# EAGLE design TA_3 (EAGLE 9.6.2)
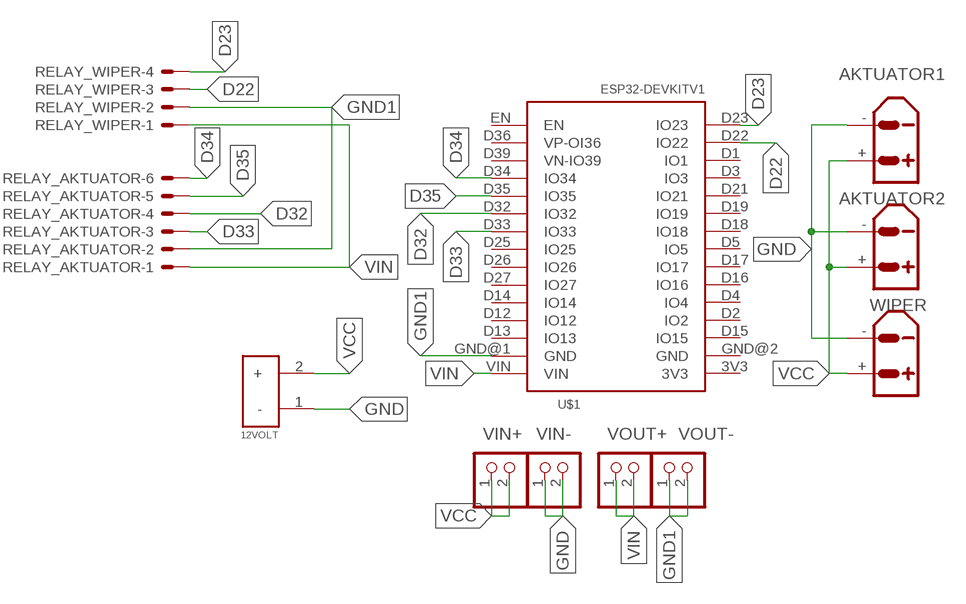
[diagram p0: schematic, sheet 1]

## Parts
12VOLT  XT60-M  [AMASS_XT60-M]
AKTUATOR1  XT30UPB-F  [XT30UPB-F]
AKTUATOR2  XT30UPB-F  [XT30UPB-F]
RELAY_AKTUATOR  JST-XH-06-PIN-LONG-PAD  [JST-XH-06-PACKAGE-LONG-PAD]
RELAY_WIPER  JST-XH-04-PIN-LONG-PAD  [JST-XH-04-PACKAGE-LONG-PAD]
U$1  ESP32DEVKITV1  [ESP32-DEVKITV1]
VIN+  PINHD-1X2  [1X02]
VIN-  PINHD-1X2  [1X02]
VOUT+  PINHD-1X2  [1X02]
VOUT-  PINHD-1X2  [1X02]
WIPER  XT30UPB-F  [XT30UPB-F]

## Nets
D22: RELAY_WIPER.3 U$1.D22(IO22)
D23: RELAY_WIPER.4 U$1.D23(IO23)
D32: RELAY_AKTUATOR.4 U$1.D32(IO32)
D33: RELAY_AKTUATOR.3 U$1.D33(IO33)
D34: RELAY_AKTUATOR.6 U$1.D34(IO34)
D35: RELAY_AKTUATOR.5 U$1.D35(IO35)
GND: 12VOLT.1(-) AKTUATOR1.- AKTUATOR2.- VIN-.1 VIN-.2 WIPER.-
GND1: RELAY_AKTUATOR.2 RELAY_WIPER.2 U$1.GND@1(GND) VOUT-.1 VOUT-.2
VCC: 12VOLT.2(+) AKTUATOR1.+ AKTUATOR2.+ VIN+.1 VIN+.2 WIPER.+
VIN: RELAY_AKTUATOR.1 RELAY_WIPER.1 U$1.VIN VOUT+.1 VOUT+.2
Unconnected: U$1.3V3 U$1.D1(IO1) U$1.D2(IO2) U$1.D3(IO3) U$1.D4(IO4) U$1.D5(IO5) U$1.D12(IO12) U$1.D13(IO13) U$1.D14(IO14) U$1.D15(IO15) U$1.D16(IO16) U$1.D17(IO17) U$1.D18(IO18) U$1.D19(IO19) U$1.D21(IO21) U$1.D25(IO25) U$1.D26(IO26) U$1.D27(IO27) U$1.D36(VP-OI36) U$1.D39(VN-IO39) U$1.EN U$1.GND@2(GND)

## Library data of the parts
12VOLT = XT60-M:XT60-M: DC supply; XT60; male; PIN:2; for cable; soldered; 60A; 500V Check availability <https://pricing.snapeda.com/parts/XT60-M/AMASS/view-part?ref=eda>; AVAILABILITY: Not in stock; DESCRIPTION: Plug; DC supply; XT60; male; PIN: 2; for cable; soldered; 30A; 500V; MF: AMASS; MP: XT60-M; PACKAGE: Package; PRICE: None
AKTUATOR1 AKTUATOR2 WIPER = amass:XT30: AMASS XT30 connector Store in Japan AMASS XT30 connector <https://szc.jp/ams-xt30>
RELAY_AKTUATOR = Rembrandt Electronics - JST XH Connectors v1-0:JST-XH-06-PIN: JST XH Connector 2 Pin Wire to board connector. Pitch: 2,54 mm, (0.100") Number of pins: 6 Created by Rembrandt Electronics www.rembrandtelectronics.com
RELAY_WIPER = Rembrandt Electronics - JST XH Connectors v1-0:JST-XH-04-PIN: JST XH Connector 2 Pin Wire to board connector. Pitch: 2,54 mm, (0.100") Number of pins: 4 Created by Rembrandt Electronics www.rembrandtelectronics.com
U$1 = ESP32-DEVKITV1:ESP32DEVKITV1
VIN+ VIN- VOUT+ VOUT- = pinhead:PINHD-1X2: PIN HEADER

## Board
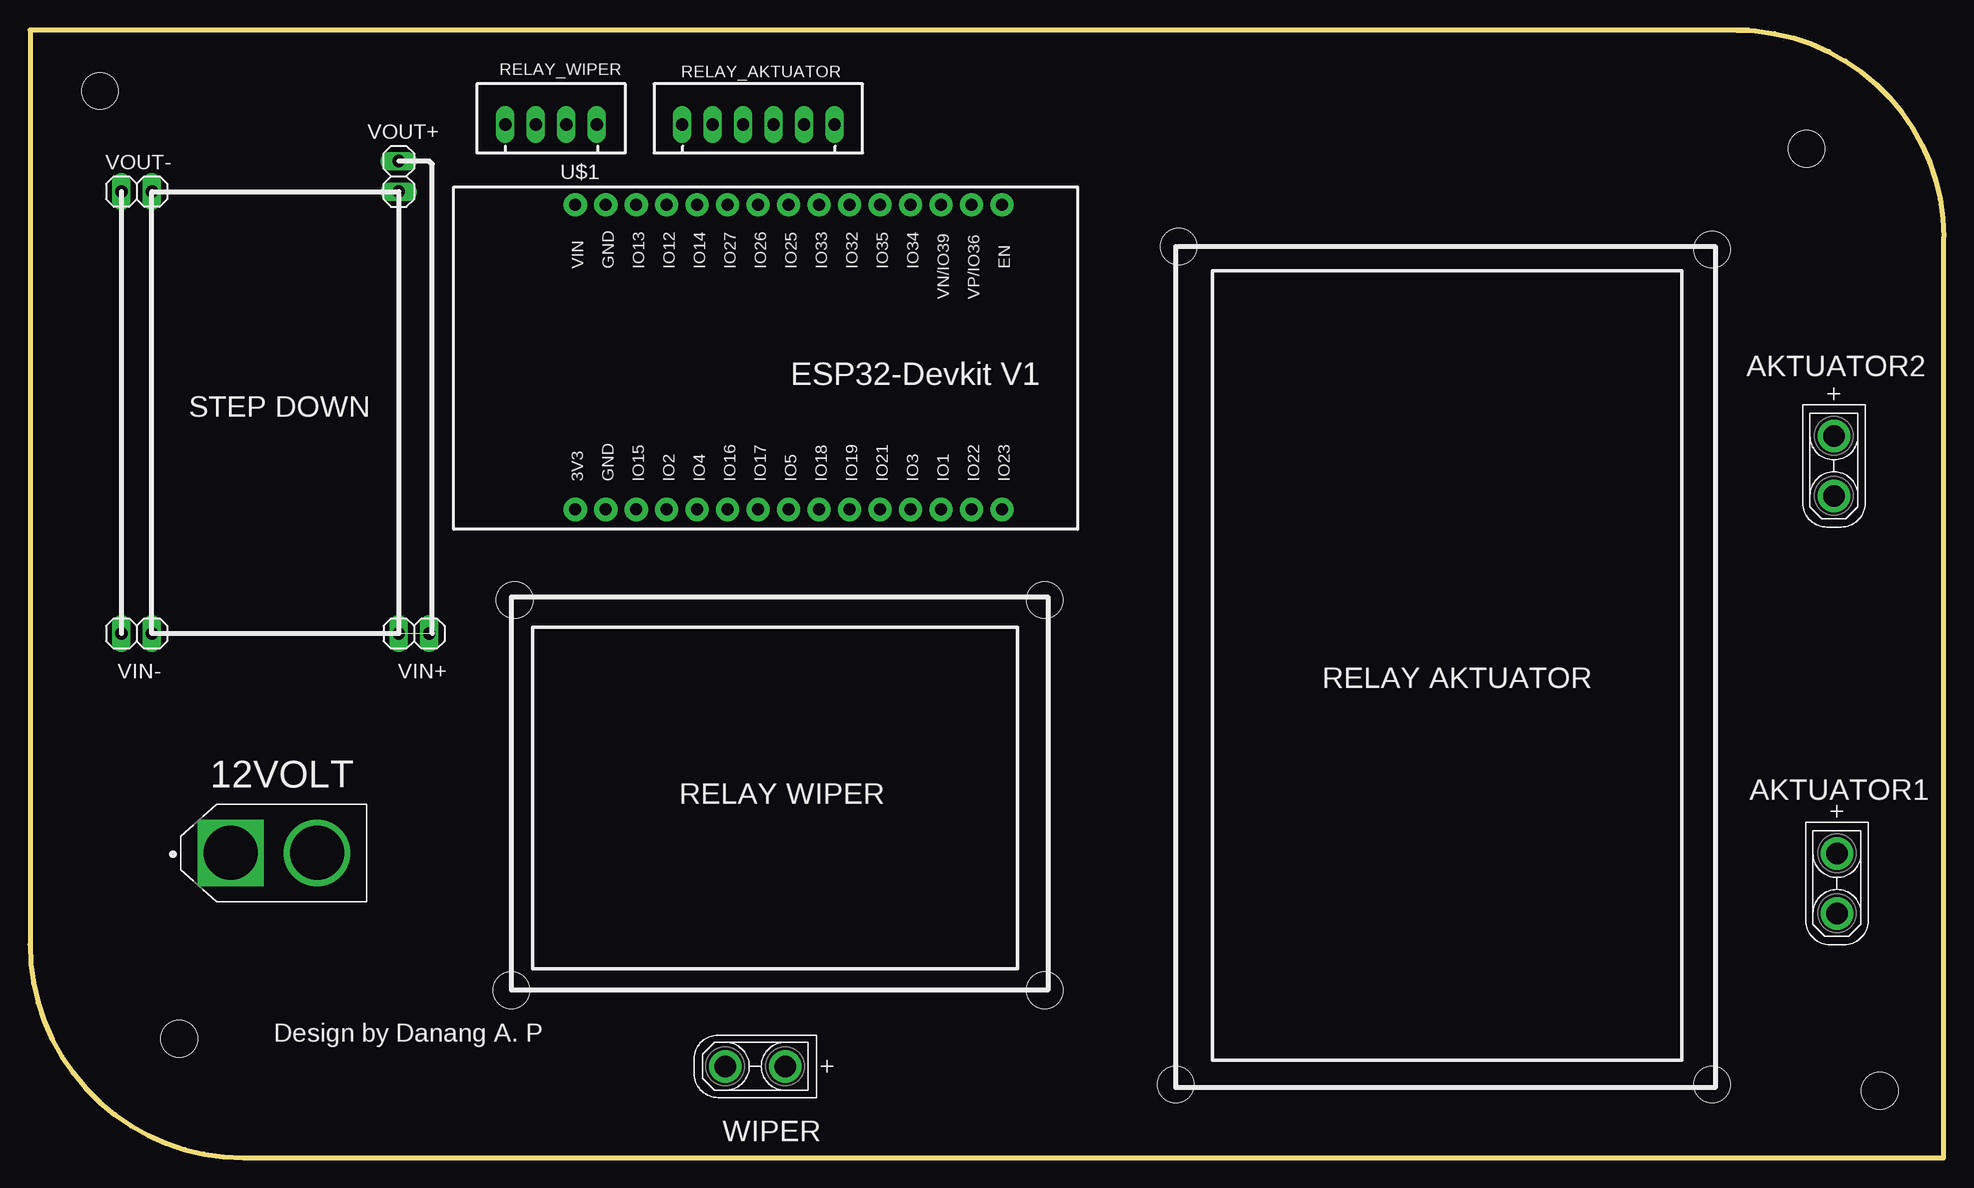
[diagram p1: board, top side]
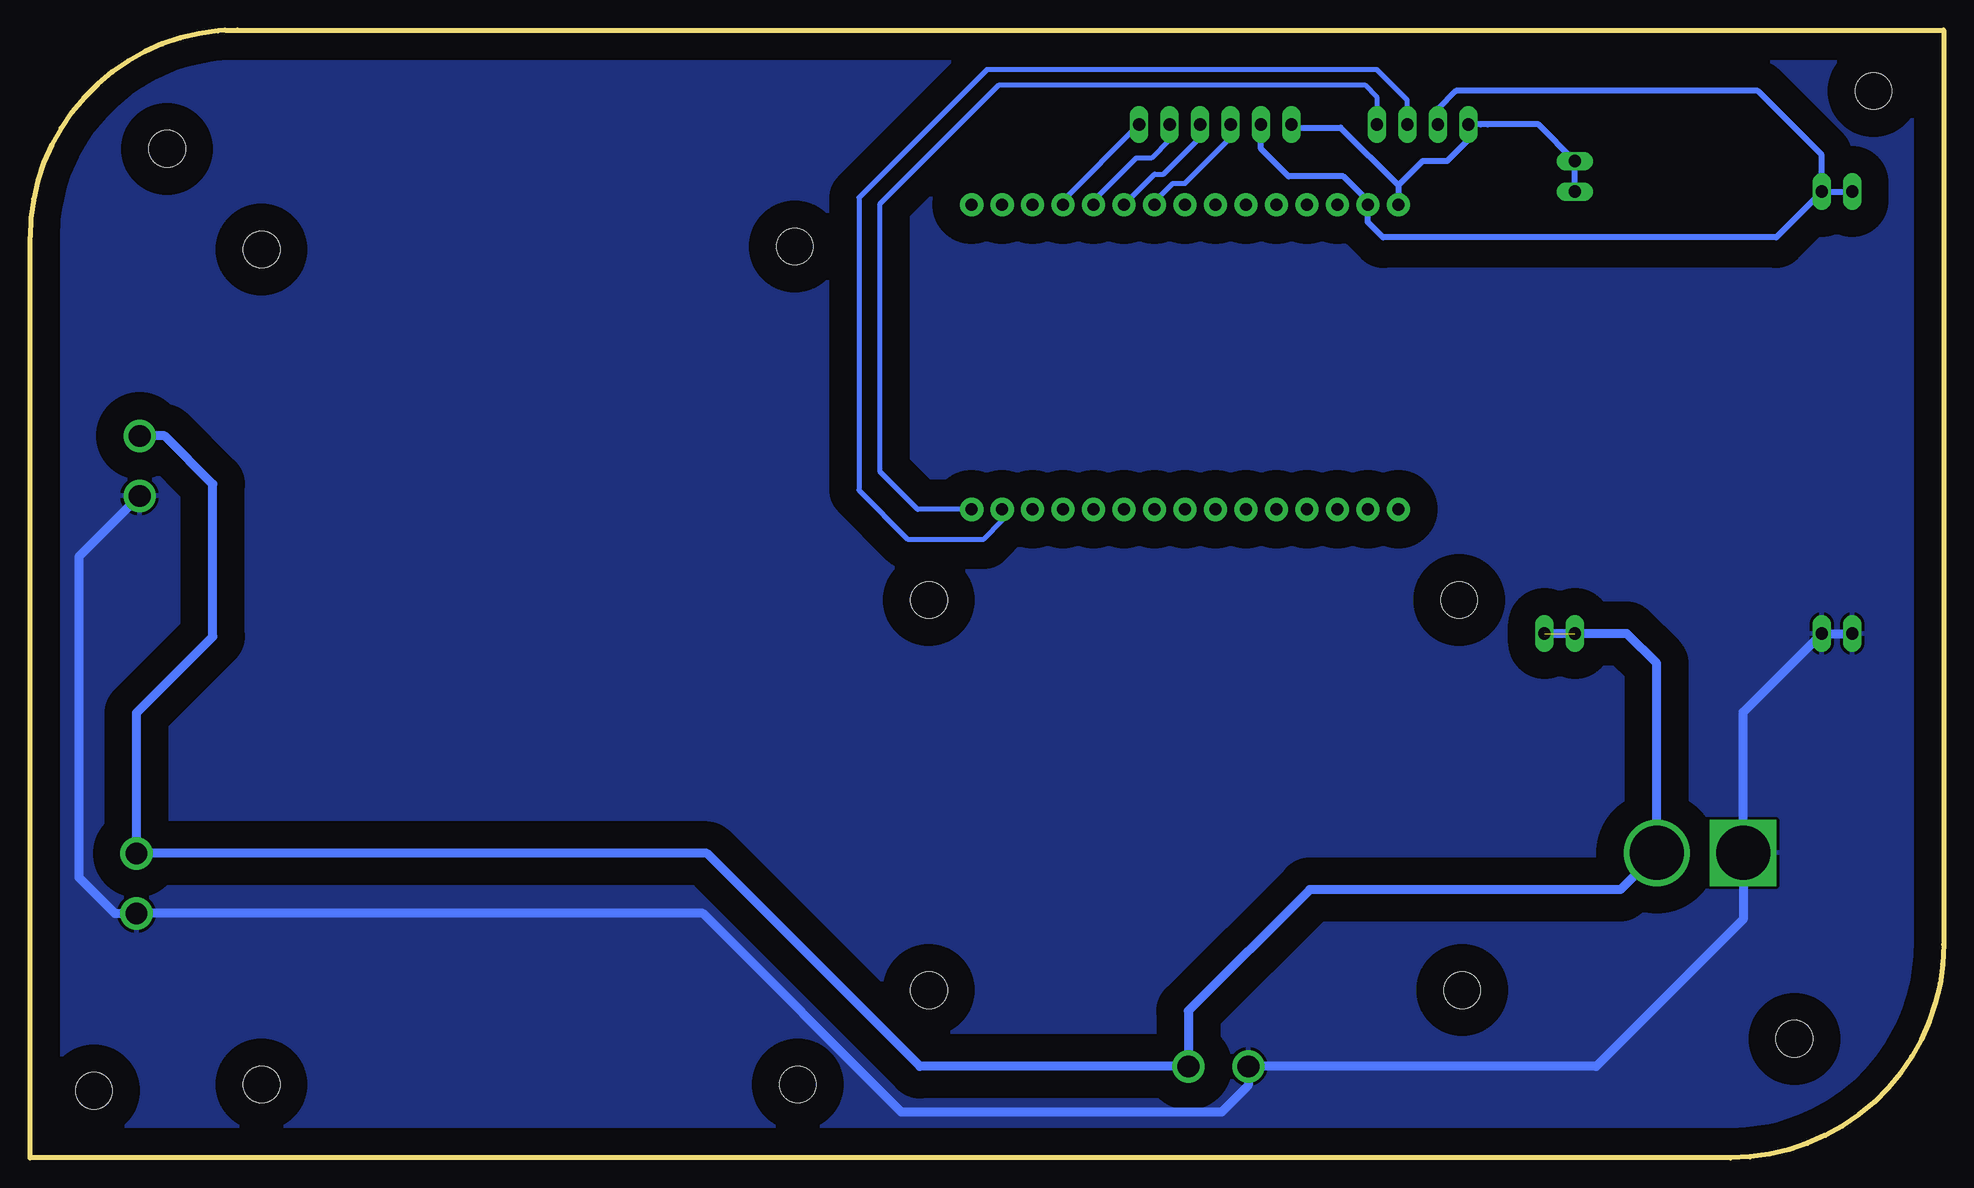
[diagram p2: board, bottom side, seen from below]

Size 159.51 x 93.98 mm. Coordinates in mm from the lower left corner, seen from the top.
Outline: 142.24,93.98 0,93.98 0,17.78 arc90 17.78,0 159.51,0 159.51,76.71 arc90 142.24,93.98
Outline: 143.26,93.98 142.24,93.98
Copper layers (1*16): Top 0.035mm / dielectric 1.5mm / Bottom 0.035mm
Design rules "default": minimum track width 6mil, minimum drill 0.35mm, track to track 6mil, track to pad 6mil, pad to pad 6mil, via to via 6mil, smd to smd 6mil, copper to edge 40mil, drill to drill 6mil, minimum pad ring 10mil, minimum via ring 8mil, stop-mask expansion 4mil, vias tented up to drill 0mil, thermal gap 10mil
Holes 3.05 mm at 40.13,13.97 40.39,46.48 84.58,13.97 84.58,46.48 95.76,75.95 140.21,75.69 140.21,6.1 95.5,6.1 154.18,5.59 5.84,88.9 148.08,84.07 12.45,9.91

### Footprints (pad centres in the part's own frame; a part is rotated, then mirrored left to right if it is on the bottom)
AMASS_XT60-M = drill 4.5 square: 1 -3.6,0 | drill 4.5: 2 3.6,0
XT30UPB-F = drill 1.8: + 2.5,0; - -2.5,0
JST-XH-06-PACKAGE-LONG-PAD = drill 1.016 long: 1 -6.35,0; 2 -3.81,0; 3 -1.27,0; 4 1.27,0; 5 3.81,0; 6 6.35,0
JST-XH-04-PACKAGE-LONG-PAD = drill 1.016 long: 1 -3.81,0; 2 -1.27,0; 3 1.27,0; 4 3.81,0
ESP32-DEVKITV1 = drill 1 pad 1.93: 3V3 -16.52,-12.27; D1 13.96,-12.27; D2 -8.9,-12.27; D3 11.42,-12.27; D4 -6.36,-12.27; D5 1.26,-12.27; D12 -8.9,13.135; D13 -11.44,13.135; D14 -6.36,13.135; D15 -11.44,-12.27; D16 -3.82,-12.27; D17 -1.28,-12.27; D18 3.8,-12.27; D19 6.34,-12.27; D21 8.88,-12.27; D22 16.5,-12.27; D23 19.04,-12.27; D25 1.26,13.135; D26 -1.28,13.135; D27 -3.82,13.135; D32 6.34,13.135; D33 3.8,13.135; D34 11.42,13.135; D35 8.88,13.135; D36 16.5,13.135; D39 13.96,13.135; EN 19.04,13.135; GND@1 -13.98,13.135; GND@2 -13.98,-12.27; VIN -16.52,13.135
1X02 = drill 1.016 long: 1 -1.27,0; 2 1.27,0

### Placement (x,y rotation side)
12VOLT  20.32,25.4 0 top
AKTUATOR1  150.62,22.86 90 top
AKTUATOR2  150.37,57.66 90 top
RELAY_AKTUATOR  60.71,86.11 0 top
RELAY_WIPER  43.43,86.11 0 top
U$1  61.98,66.29 0 top
VIN+  32,43.69 0 top
VIN-  8.89,43.69 0 top
VOUT+  30.73,81.79 90 top
VOUT-  8.89,80.52 0 top
WIPER  60.45,7.62 0 top

### Tracks (layer width: path | path; a pad name or v marks a point on that pad's centre or on a via)
D22
  Bottom 0.406: RELAY_WIPER.3 44.7,88.14 47.24,90.68 79.76,90.68 90.42,80.01 90.42,55.63 86.36,51.56 80.01,51.56 78.48,53.1 U$1.D22
D23
  Bottom 0.406: U$1.D23 85.52,54.02 88.65,57.15 88.65,79.5 78.74,89.41 48.26,89.41 47.24,88.39 RELAY_WIPER.4
D32
  Bottom 0.406: U$1.D32 65.78,81.97 65.01,81.97 61.98,85.01 RELAY_AKTUATOR.4
D33
  Bottom 0.406: RELAY_AKTUATOR.3 59.44,85.01 63.24,81.21 64.25,81.21 65.78,79.68 U$1.D33
D34
  Bottom 0.406: RELAY_AKTUATOR.6 73.4,79.77 U$1.D34
D35
  Bottom 0.406: RELAY_AKTUATOR.5 64.52,84.84 66.04,83.31 67.31,83.31 70.86,79.77 U$1.D35
GND
  Bottom 0.762: VIN-.1 VIN-.2 16.72,37.13 12VOLT.1 16.72,19.86 28.96,7.62 WIPER.- 57.95,6.06 60.2,3.81 86.87,3.81 103.42,20.36 AKTUATOR1.- 152.44,20.36 155.45,23.37 155.45,50.08 AKTUATOR2.-
  pour Bottom (isolate 2.286, rank 2): 159.51,76.45 arc90 141.99,93.98 133.35,93.98 0,93.98 0,20.07 0,17.53 arc90 17.53,0 29.97,0 159.51,0
GND1
  Bottom 0.508: VOUT-.2 13.97,76.71 46.74,76.71 48.01,77.98 U$1.GND@1 48,79.75 50.04,81.79 54.61,81.79 56.9,84.07 RELAY_AKTUATOR.2 | RELAY_WIPER.2 42.16,87.38 40.64,88.9 15.49,88.9 10.16,83.57 VOUT-.2 | VOUT-.2 VOUT-.1
VCC  (1 unrouted)
  Bottom 0.762: VIN+.2 26.42,43.69 23.92,41.19 12VOLT.2 26.97,22.35 52.83,22.35 62.95,12.23 WIPER.+ 85.34,7.62 103.08,25.36 AKTUATOR1.+ 150.62,37.08 144.27,43.43 144.27,56.13 148.3,60.16 AKTUATOR2.+
VIN
  Bottom 0.508: RELAY_AKTUATOR.1 54.1,85.85 50.28,85.85 45.46,81.03 | 45.46,81.03 45.46,81.04 43.43,83.06 41.4,83.06 39.62,84.84 RELAY_WIPER.1 38.61,86.11 38,86.11 33.78,86.11 VOUT+.2 VOUT+.1 | 45.46,81.03 U$1.VIN

### Text on the board
tPlace: STEP DOWN | RELAY AKTUATOR | RELAY WIPER | Design by Danang A. P